# Altium schematic sheet INTERFACE_EXT.SchDoc
size A3; SheetNumber: 5; SheetTotal: 7
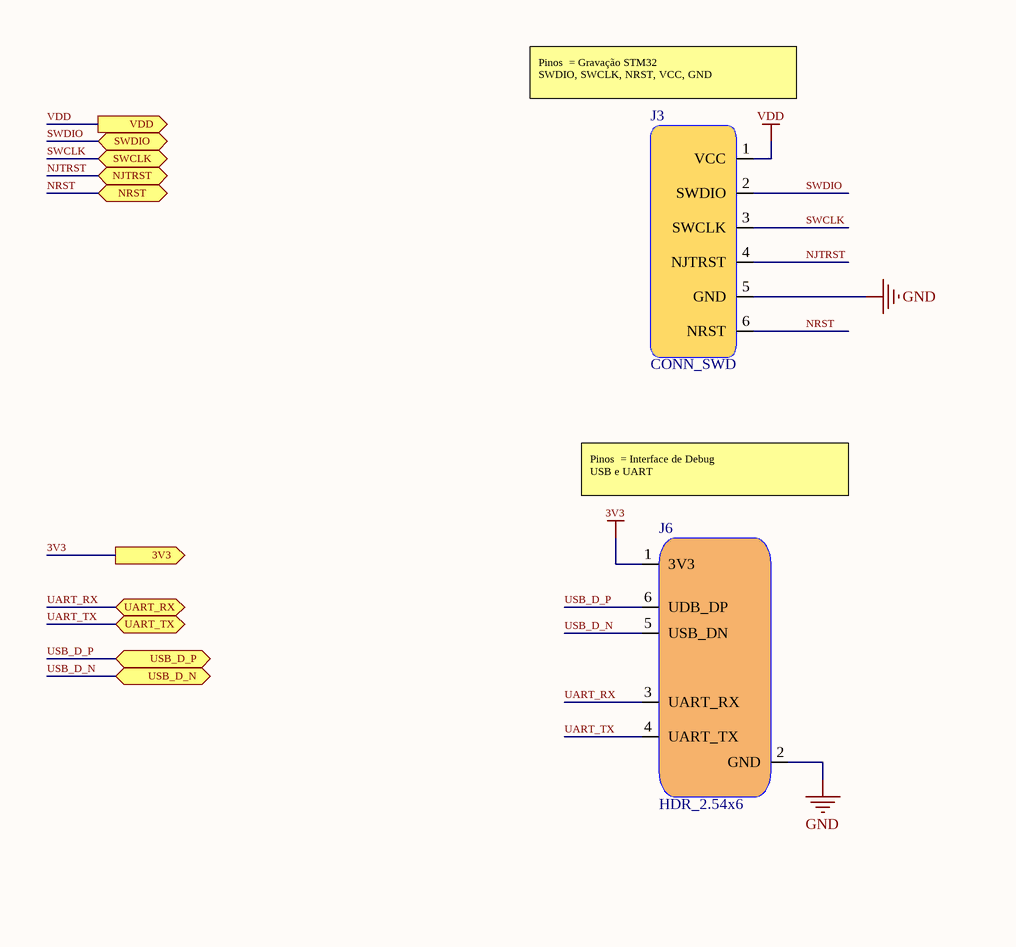
[diagram p0: INTERFACE_EXT.SchDoc, left]
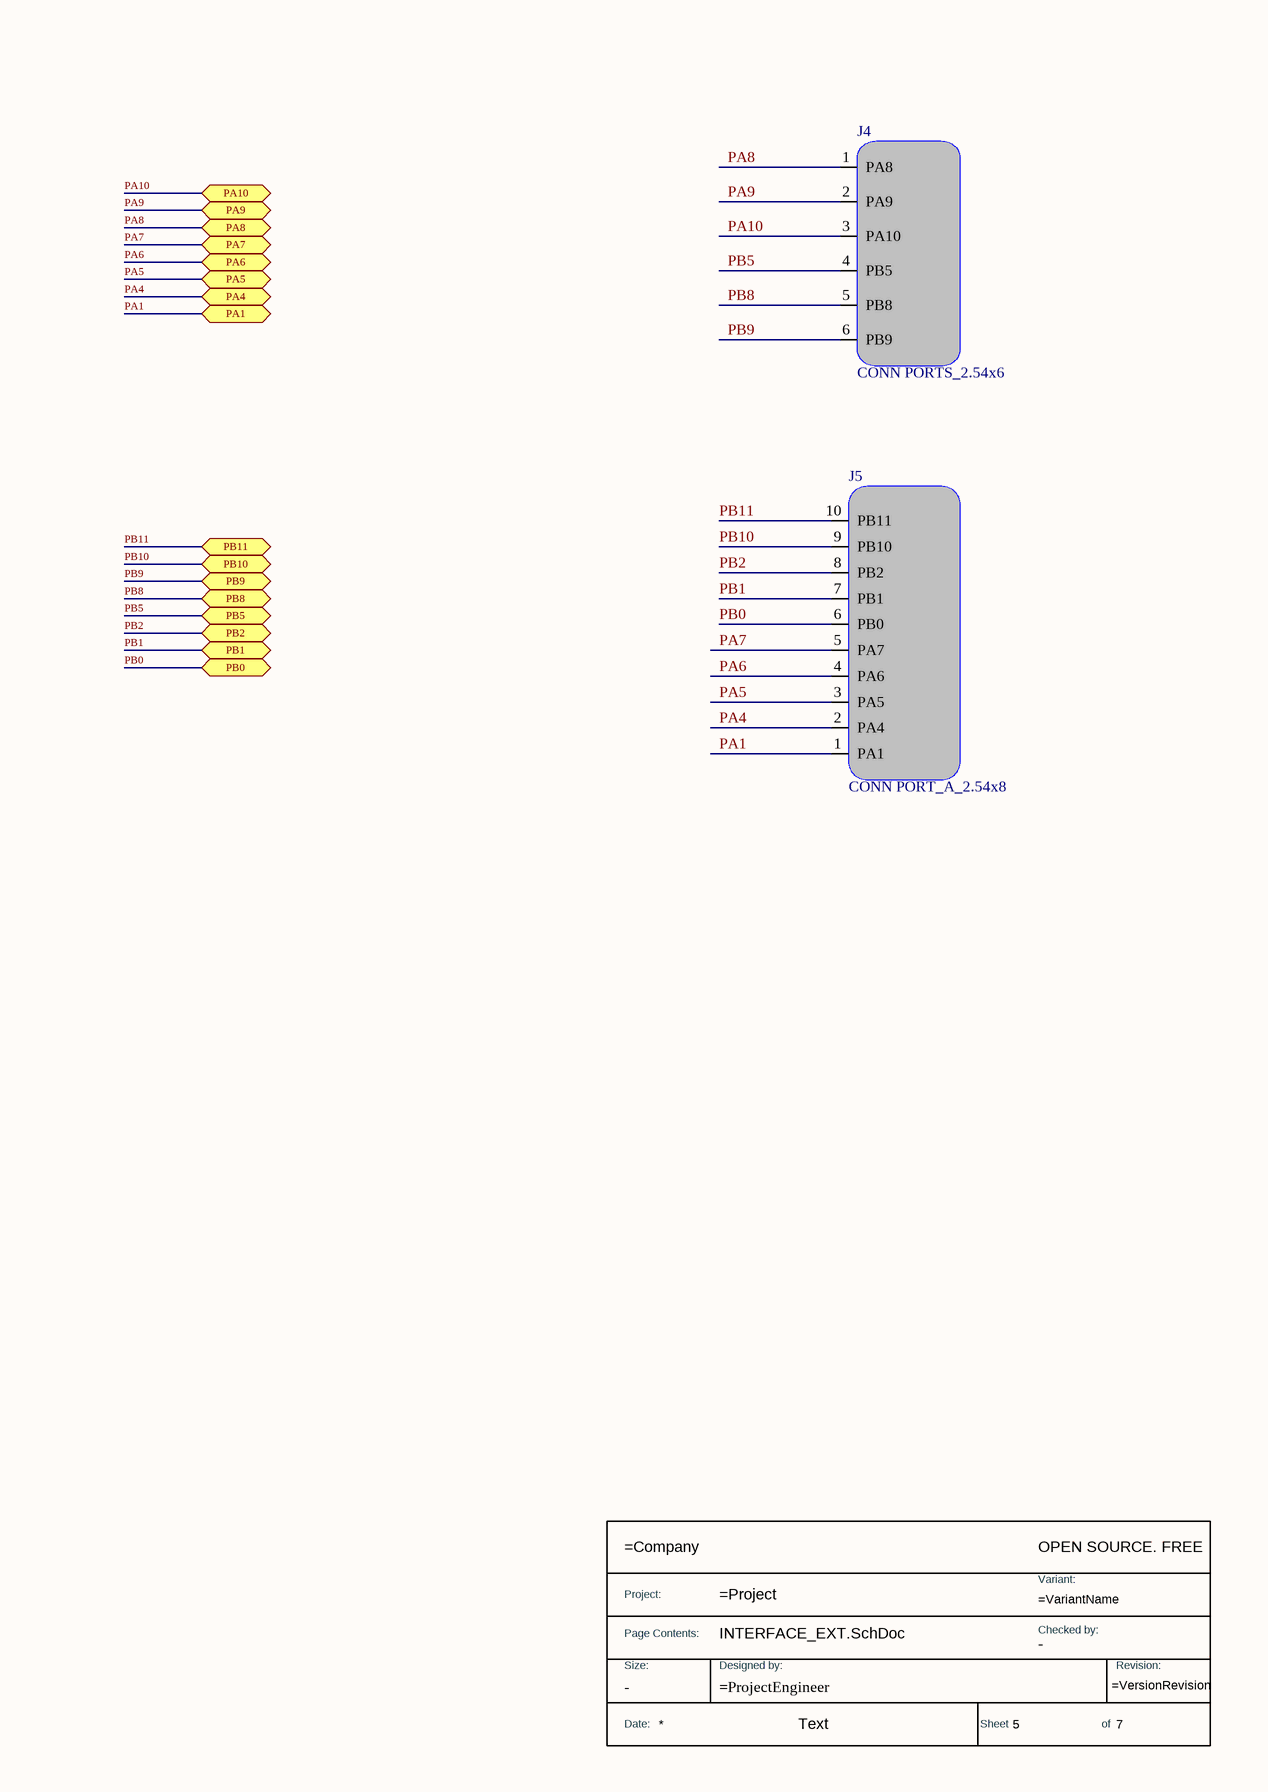
[diagram p1: INTERFACE_EXT.SchDoc, right]

## Parts
*  TitleBlock  (value not drawn)  (graphical)
J3  CONN_SWD  [CONN_5POS_2.54MM]
J4  CONN PORTS_2.54x6  [CONN_HDR_2.54x6 - PA]
J5  CONN PORT_A_2.54x8  [CONN_HDR_2.54x10 - PB]
J6  HDR_2.54x6  [HDR_2.54x6]

## Ports
3V3 (out, see 1[6B], 3[8B], 4[1A], 6[1A], 7[1A]), NJTRST (bidir, see 1[6B], 6[8A]), NRST (bidir, see 1[6B], 6[8A]), PA1 (bidir, see 1[6C], 6[8C]), PA4 (bidir, see 1[6C], 6[8C]), PA5 (bidir, see 1[6C], 6[8C]), PA6 (bidir, see 1[6C], 6[8C]), PA7 (bidir, see 1[6C], 6[8C]), PA8 (bidir, see 1[6C], 6[8C]), PA9 (bidir, see 1[6C], 6[8C]), PA10 (bidir, see 1[6C], 6[8C]), PB0 (bidir, see 1[6C], 6[8C]), PB1 (bidir, see 1[6C], 6[8C]), PB2 (bidir, see 1[6C], 6[8C]), PB5 (bidir, see 1[6C], 6[8C]), PB8 (bidir, see 1[6C], 6[8C]), PB9 (bidir, see 1[6C], 6[8C]), PB10 (bidir, see 1[6C], 6[8C]), PB11 (bidir, see 1[6C], 6[8C]), SWCLK (bidir, see 1[6B], 6[8A]), SWDIO (bidir, see 1[6B], 6[8A]), UART_RX (bidir, see 1[6C], 6[8B]), UART_TX (bidir, see 1[6C], 6[8B]), USB_D_N (bidir, see 1[6C], 2[5C], 2[8B], 6[6B]), USB_D_P (bidir, see 1[6C], 2[5C], 2[8B], 6[6B]), VDD (out, see 1[6B], 6[8A])

## Nets
3V3: J6.1(3V3) ; port 3V3
GND: J3.5(GND) J6.2(GND)
VDD: J3.1(VCC) ; port VDD
NJTRST: J3.4(NJTRST) ; port NJTRST
NRST: J3.6(NRST) ; port NRST
PA1: J5.1(PA1) ; port PA1
PA4: J5.2(PA4) ; port PA4
PA5: J5.3(PA5) ; port PA5
PA6: J5.4(PA6) ; port PA6
PA7: J5.5(PA7) ; port PA7
PA8: J4.1(PA8) ; port PA8
PA9: J4.2(PA9) ; port PA9
PA10: J4.3(PA10) ; port PA10
PB0: J5.6(PB0) ; port PB0
PB1: J5.7(PB1) ; port PB1
PB2: J5.8(PB2) ; port PB2
PB5: J4.4(PB5) ; port PB5
PB8: J4.5(PB8) ; port PB8
PB9: J4.6(PB9) ; port PB9
PB10: J5.9(PB10) ; port PB10
PB11: J5.10(PB11) ; port PB11
SWCLK: J3.3(SWCLK) ; port SWCLK
SWDIO: J3.2(SWDIO) ; port SWDIO
UART_RX: J6.3(UART_RX) ; port UART_RX
UART_TX: J6.4(UART_TX) ; port UART_TX
USB_D_N: J6.5(USB_DN) ; port USB_D_N
USB_D_P: J6.6(UDB_DP) ; port USB_D_P

## Notes on the sheet
- (near J3) Pinos  = Gravação STM32
  SWDIO, SWCLK, NRST, VCC, GND
- Pinos  = Interface de Debug
  USB e UART
- Todas as informações e detalhes técnicos deste documento são de inteira propriedade da empresa V2COM,
- não poderão ser copiados, reduzidos ou cedidos a terceiros sem prévia autorização por escrito da mesma.
- Salvo em (D/M/A):
- Página:
- de
- Nome do Projeto:
- https://v2com.com/
- Ed.:
- Responsável:
- Nome da página:
- Rev.:
- Projetista:
- Obs.:
- Revisor:
- Arquivo:
- -
- (in symbol TitleBlock) OPEN SOURCE. FREE; Project:; Variant:; Page Contents:; Checked by:; Size:; Designed by:; Revision:; Date:; Text; Sheet; of

## Library data of the parts
* = TitleBlock: Standard Title Block; DWG NO: =ProjectEngineer; Size: -; Checked by: -
J4 = CONN PORTS_2.54x6: CONN HDR FEMALE 2.54 x 6POS
J5 = CONN PORT_A_2.54x8: CONN HDR FEMALE 2.54 x 8POS
J6 = HDR_2.54x6: CONN HDR FEMALE 2.54x6